# Altium schematic sheet test.SchDoc
size A4
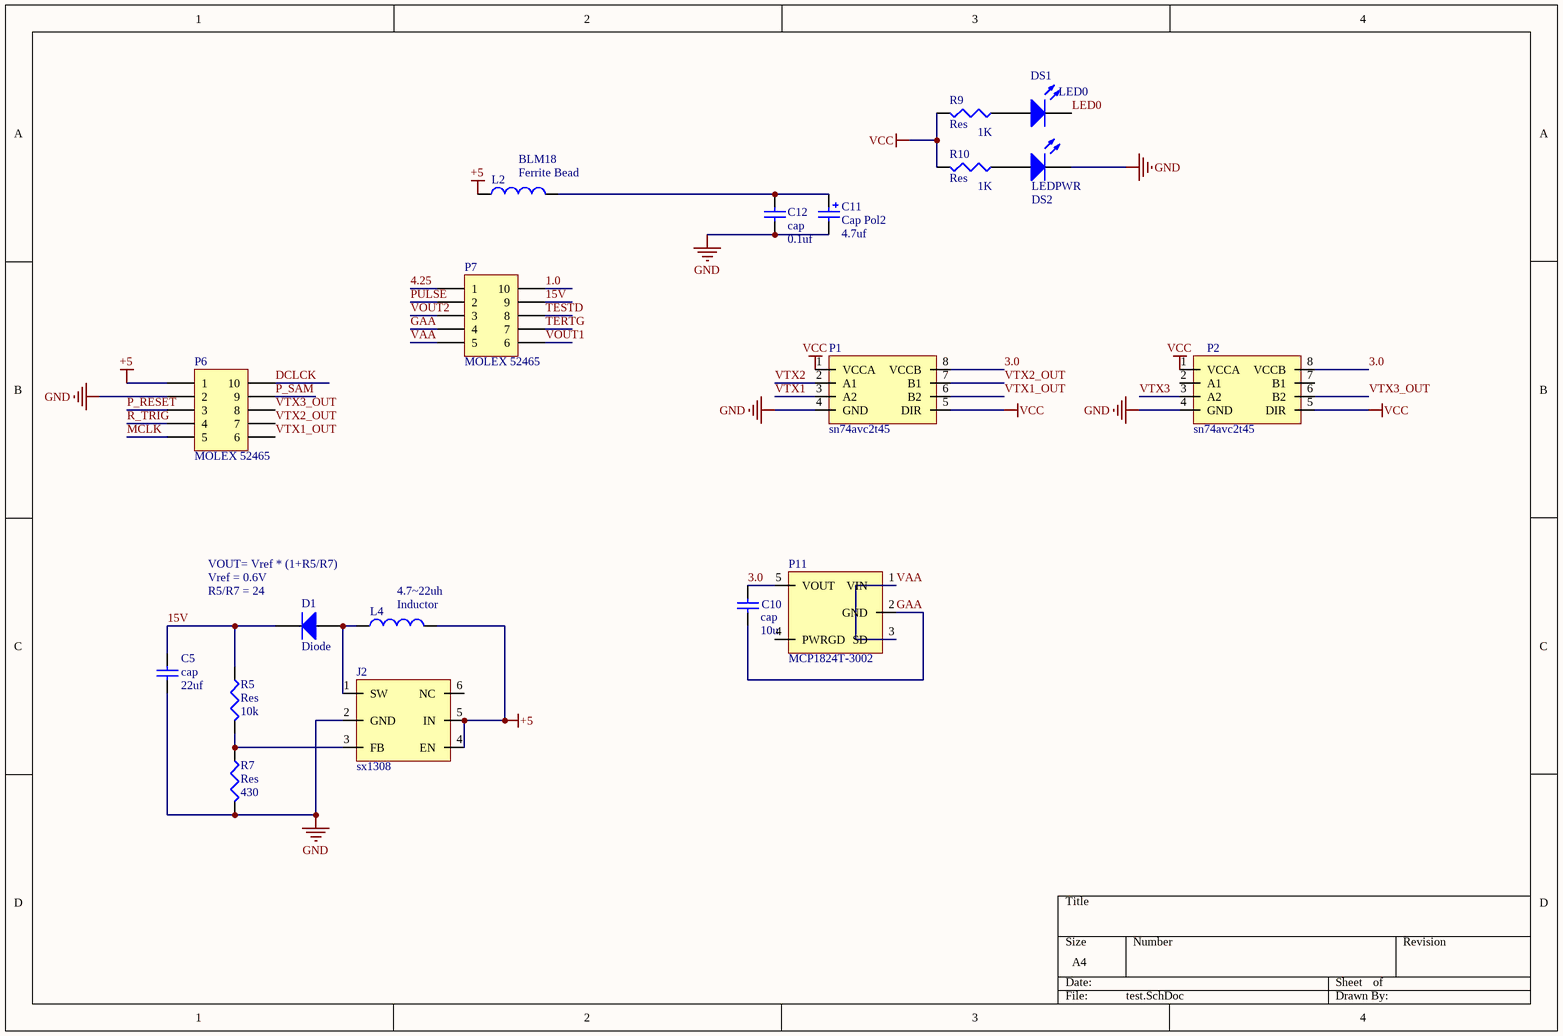
[diagram p0: test.SchDoc]

## Parts
C5  cap  value 22uf  [J1-0603]
C10  cap  value 10u  [J1-0603]
C11  Cap Pol2  value 4.7uf  [C1206+]
C12  cap  value 0.1uf  [J1-0603]
D1  Diode  [D1206]
DS1  LED0  [SMDLED]
DS2  LEDPWR  [SMDLED]
J2  sx1308  [sot23-6]
L2  Ferrite Bead  value BLM18  [J1-0603]
L4  Inductor  value 4.7~22uh  [induct4*4]
P1  sn74avc2t45  [TSSOP8]
P2  sn74avc2t45  [TSSOP8]
P6  MOLEX 52465  [btb10p_m]
P7  MOLEX 52465  [btb10p_m]
P11  MCP1824T-3002  [SOT-23]
R5  Res  value 10k  [J1-0603]
R7  Res  value 430  [J1-0603]
R9  Res  value 1K  [J1-0603]
R10  Res  value 1K  [J1-0603]

## Nets
+5: J2.4(EN) J2.5(IN) L2.1 L4.2 P6.1
GND: C5.1 C11.2 C12.1 DS2.2(K) J2.2(GND) P1.4(GND) P2.4(GND) P6.2 R7.2
VCC: P1.1(VCCA) P1.5(DIR) P2.1(VCCA) P2.5(DIR) R9.2 R10.2
1.0: P7.10
3.0: C10.2 P1.8(VCCB) P2.8(VCCB) P11.5(VOUT)
4.25: P7.1
15V: C5.2 D1.2(K) P7.9 R5.1
DCLCK: P6.10
GAA: C10.1 P7.4 P11.2(GND)
LED0: DS1.2(K)
MCLK: P6.5
P_RESET: P6.3
P_SAM: P6.9
PULSE: P7.2
R_TRIG: P6.4
TERTG: P7.7
TESTD: P7.8
VAA: P7.5 P11.1(VIN) P11.3(SD)
VOUT1: P7.6
VOUT2: P7.3
VTX1: P1.3(A2)
VTX1_OUT: P1.6(B2) P6.6
VTX2: P1.2(A1)
VTX2_OUT: P1.7(B1) P6.7
VTX3: P2.3(A2)
VTX3_OUT: P2.6(B2) P6.8
NetC11_1: C11.1 C12.2 L2.2
NetD1_1: D1.1(A) J2.1(SW) L4.1
NetDS1_1: DS1.1(A) R9.1
NetDS2_1: DS2.1(A) R10.1
NetJ2_3: J2.3(FB) R5.2 R7.1

Not connected (* = marked no-connect by the designer): J2 6(NC); P2 2(A1) 7(B1); P11 4(PWRGD)

## Notes on the sheet
- VOUT= Vref * (1+R5/R7)
- (near D1) Vref = 0.6V
- (near D1) R5/R7 = 24

## Library data of the parts
C5 C10 C12 = Cap Semi: Capacitor (Semiconductor SIM Model); Published: 8-Jun-2000; LatestRevisionDate: 29-May-2009; LatestRevisionNote: IPC-7351 Footprint Added.; PackageReference: C1206; Publisher: Altium Limited; PackageDescription: Chip Capacitor
C11 = Cap Pol2: Polarized Capacitor (Axial); Published: 8-Jun-2000; LatestRevisionDate: 17-Jul-2002; LatestRevisionNote: Re-released for DXP Platform.; PackageReference: POLAR0.8; Publisher: Altium Limited; PackageDescription: Polarized Capacitor; 2 Leads
D1 = Diode: Default Diode; Published: 8-Jun-2000; LatestRevisionDate: 17-Jul-2002; LatestRevisionNote: Re-released for DXP Platform.; PackageVersion: Sep-1996; PackageReference: SMC; Publisher: Altium Limited; PackageDescription: DO-214-AB/SMC; 2 C-Bend Leads; Body 7.9 x 5.9 mm, inc. leads (LxW); Code_JEDEC: DO-214-AB
DS1 DS2 = LED2: Typical RED, GREEN, YELLOW, AMBER GaAs LED; Published: 8-Jun-2000; LatestRevisionDate: 17-Jul-2002; LatestRevisionNote: Re-released for DXP Platform.; PackageDocument: Feb-2002; PackageReference: 3.2X1.6X1.1; Publisher: Altium Limited
L2 L4 = Inductor: Code_IEC: 1005; Published: 8-Jun-2000; LatestRevisionDate: 29-May-2009; LatestRevisionNote: IPC-7351 Footprint Added.; PackageReference: 0402-A; Publisher: Altium Limited; PackageDescription: Chip Inductor; Code_JEITA: 0402
P6 P7 = header10
P11 = VOLTREG
R5 R7 R9 R10 = Res3: Resistor; Published: 8-Jun-2000; LatestRevisionDate: 29-May-2009; LatestRevisionNote: IPC-7351 Footprint Added.; PackageReference: J1-0603; Publisher: Altium Limited; PackageDescription: Chip Resistor